# Altium schematic sheet LPCB221 - CORE INTERFACE.SchDoc
size A3; Address1: Factory 10; Address2: 9-13 Dingley Avenue, Dandeong, VICTORIA 3175, AUSTRALIA; DocumentNumber: 2; Revision: 1; SheetNumber: 2; SheetTotal: 6; Lockie__PCB_SUB_ASSEMBLY: Core Interface; Lockie__PCB_ASSEMBLY: Node Base; Lockie__LDL: LPCB221; Lockie__PCB_DESCRIPTION: Gimbal Node
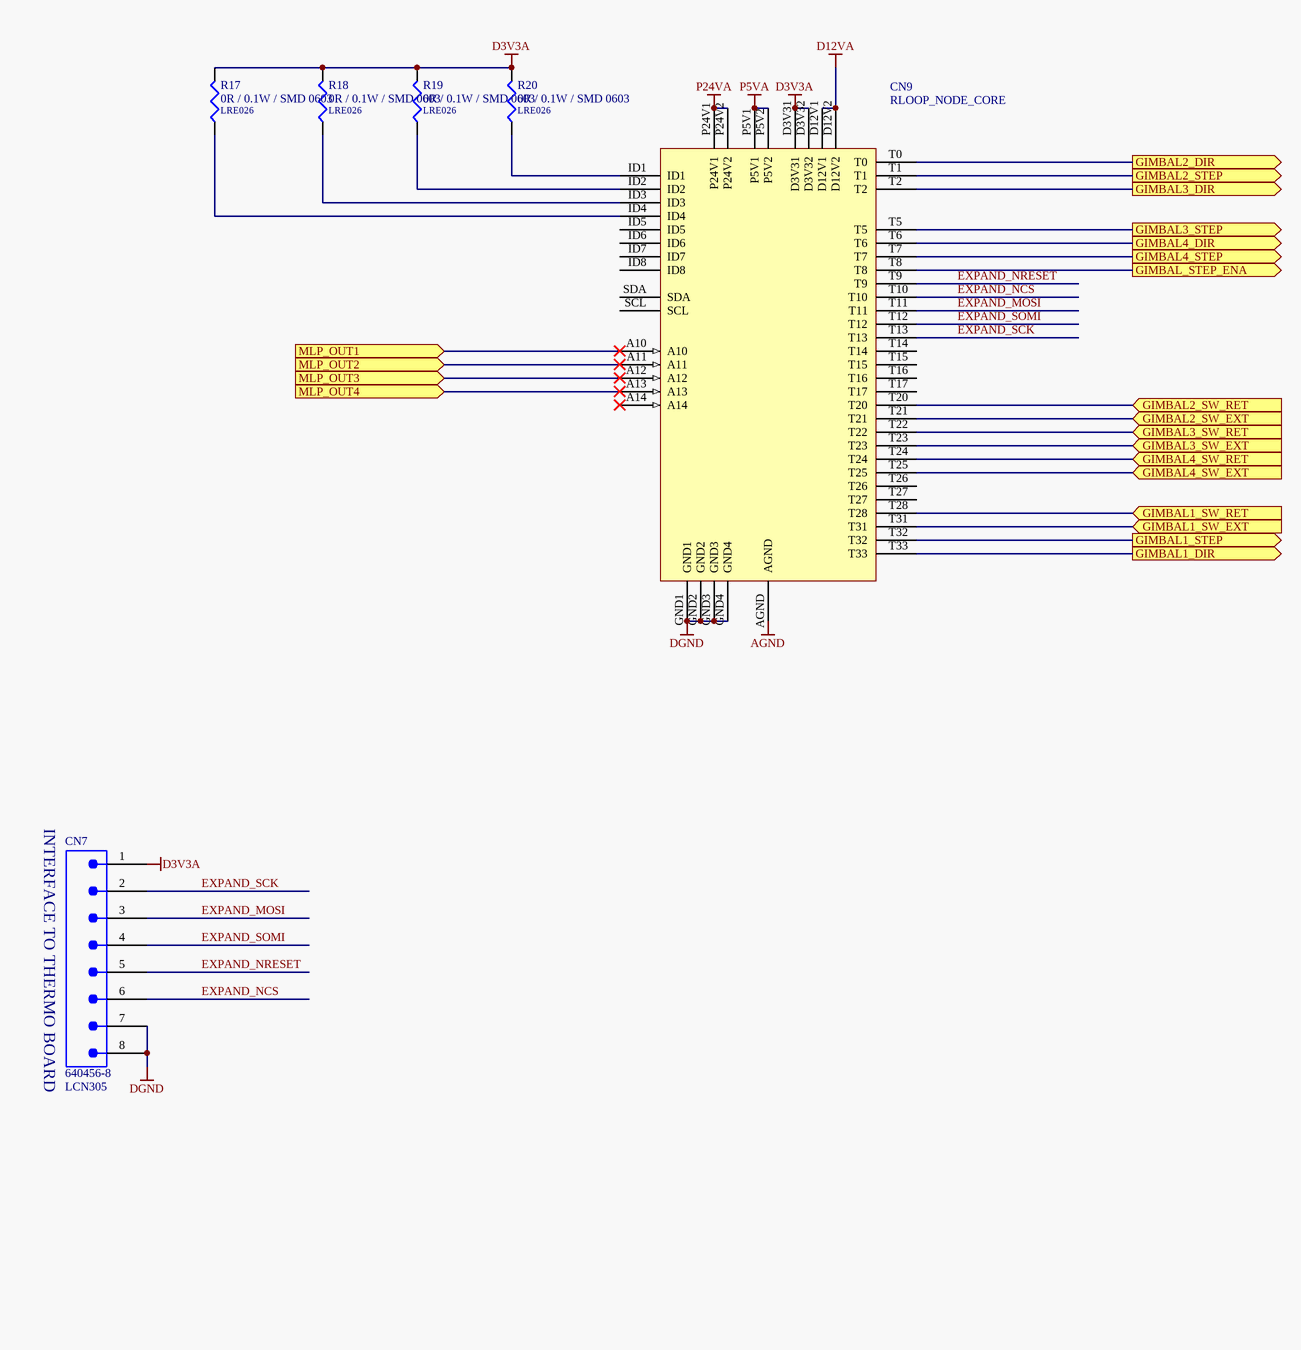
[diagram p0: LPCB221 - CORE INTERFACE.SchDoc]

## Parts
CN7  640456-8  LDL_NUMBER: LCN305  [640456-8]
CN9  RLOOP_NODE_CORE  [RLOOP_NODE_CORE]  (no BOM)
R17  0R / 0.1W / SMD 0603  LDL_NUMBER: LRE026  [LFP020__CR1608-0603-IPC7351_B]
R18  0R / 0.1W / SMD 0603  LDL_NUMBER: LRE026  [LFP020__CR1608-0603-IPC7351_B]
R19  0R / 0.1W / SMD 0603  LDL_NUMBER: LRE026  [LFP020__CR1608-0603-IPC7351_B]
R20  0R / 0.1W / SMD 0603  LDL_NUMBER: LRE026  [LFP020__CR1608-0603-IPC7351_B]

## Ports
GIMBAL1_DIR (out), GIMBAL1_STEP (out), GIMBAL1_SW_EXT (in), GIMBAL1_SW_RET (in), GIMBAL2_DIR (out), GIMBAL2_STEP (out), GIMBAL2_SW_EXT (in), GIMBAL2_SW_RET (in), GIMBAL3_DIR (out), GIMBAL3_STEP (out), GIMBAL3_SW_EXT (in), GIMBAL3_SW_RET (in), GIMBAL4_DIR (out), GIMBAL4_STEP (out), GIMBAL4_SW_EXT (in), GIMBAL4_SW_RET (in), GIMBAL_STEP_ENA (out), MLP_OUT1 (in), MLP_OUT2 (in), MLP_OUT3 (in), MLP_OUT4 (in)

## Nets
AGND: CN9.AGND
D3V3A: CN7.1 CN9.D3V31 CN9.D3V32 R17.2 R18.2 R19.2 R20.2
D12VA: CN9.D12V1 CN9.D12V2
DGND: CN7.7 CN7.8 CN9.GND1 CN9.GND2 CN9.GND3 CN9.GND4
P5VA: CN9.P5V1 CN9.P5V2
P24VA: CN9.P24V1 CN9.P24V2
EXPAND_MOSI: CN7.3 CN9.T11
EXPAND_NCS: CN7.6 CN9.T10
EXPAND_NRESET: CN7.5 CN9.T9
EXPAND_SCK: CN7.2 CN9.T13
EXPAND_SOMI: CN7.4 CN9.T12
GIMBAL1_DIR: CN9.T33 ; port GIMBAL1_DIR
GIMBAL1_STEP: CN9.T32 ; port GIMBAL1_STEP
GIMBAL1_SW_EXT: CN9.T31 ; port GIMBAL1_SW_EXT
GIMBAL1_SW_RET: CN9.T28 ; port GIMBAL1_SW_RET
GIMBAL2_DIR: CN9.T0 ; port GIMBAL2_DIR
GIMBAL2_STEP: CN9.T1 ; port GIMBAL2_STEP
GIMBAL2_SW_EXT: CN9.T21 ; port GIMBAL2_SW_EXT
GIMBAL2_SW_RET: CN9.T20 ; port GIMBAL2_SW_RET
GIMBAL3_DIR: CN9.T2 ; port GIMBAL3_DIR
GIMBAL3_STEP: CN9.T5 ; port GIMBAL3_STEP
GIMBAL3_SW_EXT: CN9.T23 ; port GIMBAL3_SW_EXT
GIMBAL3_SW_RET: CN9.T22 ; port GIMBAL3_SW_RET
GIMBAL4_DIR: CN9.T6 ; port GIMBAL4_DIR
GIMBAL4_STEP: CN9.T7 ; port GIMBAL4_STEP
GIMBAL4_SW_EXT: CN9.T25 ; port GIMBAL4_SW_EXT
GIMBAL4_SW_RET: CN9.T24 ; port GIMBAL4_SW_RET
GIMBAL_STEP_ENA: CN9.T8 ; port GIMBAL_STEP_ENA
MLP_OUT1: CN9.A10 ; port MLP_OUT1
MLP_OUT2: CN9.A11 ; port MLP_OUT2
MLP_OUT3: CN9.A12 ; port MLP_OUT3
MLP_OUT4: CN9.A13 ; port MLP_OUT4
NetCN9_ID1: CN9.ID1 R20.1
NetCN9_ID2: CN9.ID2 R19.1
NetCN9_ID3: CN9.ID3 R18.1
NetCN9_ID4: CN9.ID4 R17.1

Not connected (* = marked no-connect by the designer): CN9 A14* ID5 ID6 ID7 ID8 SCL SDA T14 T15 T16 T17 T26 T27

## Notes on the sheet
- (near CN7) INTERFACE TO THERMO BOARD
- PCB COMPONENT DESCRIPTION
- LDL NUMBER
- Assembly Details
- Size
- Drawing File Name
- Revision
- http://rloop.org
- Scale
- A3
- Sheet Details
- N.T.S
- Sheet:
- Of:

## Library data of the parts
CN7 = 640456-8: Connector, Male Header, 8 Way; FMEDA__CHANNEL: COM; FMEDA__OPERATING__CURRENT_MAX: 0; FMEDA__OPERATING__TEMP_MAX: 50; FMEDA__OPERATING__TEMP_MIN: -20; FMEDA__OPERATING__TEMP_TYP: 27; FMEDA__OPERATING__VOLTAGE_MAX: 16; FMEDA__OPERATING__VOLTAGE_TYP: 12; FMEDA__FUNCTION_IN_SYSTEM: *; FMEDA__OPERATING__CURRENT_MIN: 0; FMEDA__OPERATING__CURRENT_TYP: 0; FMEDA__OPERATING__VOLTAGE_MIN: 0
CN9 = RLOOP_NODE_CORE: rLoop Node Core Connector; FMEDA__CHANNEL: COM; FMEDA__OPERATING__CURRENT_MAX: 0; FMEDA__OPERATING__TEMP_MAX: 50; FMEDA__OPERATING__TEMP_MIN: -20; FMEDA__OPERATING__TEMP_TYP: 27; FMEDA__OPERATING__VOLTAGE_MAX: 16; FMEDA__OPERATING__VOLTAGE_TYP: 12; FMEDA__OPERATING__CURRENT_MIN: 0; FMEDA__OPERATING__CURRENT_TYP: 0; FMEDA__OPERATING__VOLTAGE_MIN: 0
R17-R20 = 0R / 0.1W / SMD 0603: Resistor, Ceramic Chip, 0R, 0.1W, SMD 0603 [LRE026]; Value: 0; FMEDA__OPERATING__TEMP_MAX: 50; FMEDA__OPERATING__TEMP_MIN: -20; FMEDA__OPERATING__TEMP_TYP: 27; FMEDA__CHANNEL: COM; FMEDA__OPERATING__POWER_MAX: 0; FMEDA__OPERATING__POWER_MIN: 0; FMEDA__OPERATING__VOLTAGE_MAX: 0; FMEDA__OPERATING__VOLTAGE_MIN: 0; FMEDA__OPERATING__VOLTAGE_TYP: 0; FMEDA__FUNCTION_IN_SYSTEM: *